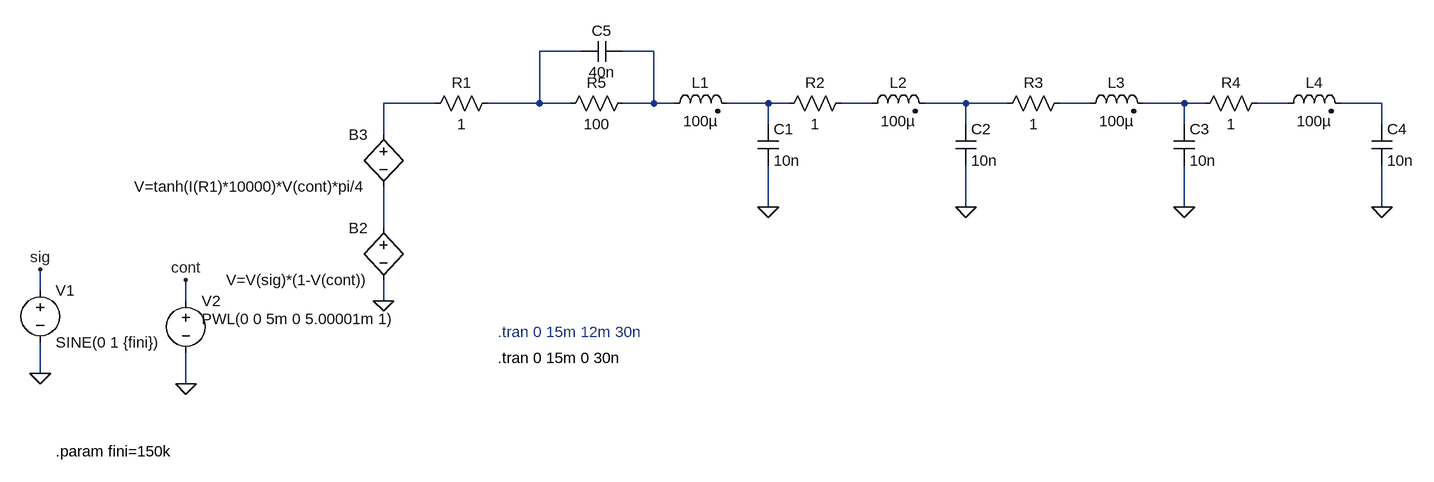
[diagram p0: schematic TLine_PTS_v2.asc]
TLine_PTS_v2.asc, the LTspice schematic file:
Version 4
SHEET 1 1736 680
WIRE 448 -128 384 -128
WIRE 560 -128 512 -128
WIRE 224 -48 144 -48
WIRE 384 -48 384 -128
WIRE 384 -48 304 -48
WIRE 432 -48 384 -48
WIRE 560 -48 560 -128
WIRE 560 -48 512 -48
WIRE 592 -48 560 -48
WIRE 736 -48 672 -48
WIRE 768 -48 736 -48
WIRE 896 -48 848 -48
WIRE 1040 -48 976 -48
WIRE 1104 -48 1040 -48
WIRE 1232 -48 1184 -48
WIRE 1376 -48 1312 -48
WIRE 1408 -48 1376 -48
WIRE 1536 -48 1488 -48
WIRE 1680 -48 1616 -48
WIRE 736 -16 736 -48
WIRE 1040 -16 1040 -48
WIRE 1376 -16 1376 -48
WIRE 1680 -16 1680 -48
WIRE 144 0 144 -48
WIRE 736 112 736 48
WIRE 1040 112 1040 48
WIRE 1376 112 1376 48
WIRE 1680 112 1680 48
WIRE 144 144 144 80
WIRE -384 240 -384 208
WIRE -160 256 -160 224
WIRE 144 256 144 224
WIRE -384 368 -384 320
WIRE -160 384 -160 336
FLAG -384 368 0
FLAG -160 384 0
FLAG -160 224 cont
FLAG -384 208 sig
FLAG 144 256 0
FLAG 736 112 0
FLAG 1040 112 0
FLAG 1376 112 0
FLAG 1680 112 0
SYMBOL res 208 -32 R270
WINDOW 0 32 56 VTop 2
WINDOW 3 0 56 VBottom 2
SYMATTR InstName R1
SYMATTR Value 1
SYMBOL voltage -384 224 R0
WINDOW 123 0 0 Left 0
WINDOW 39 0 0 Left 0
SYMATTR InstName V1
SYMATTR Value SINE(0 1 {fini})
SYMBOL voltage -160 240 R0
WINDOW 123 0 0 Left 0
WINDOW 39 0 0 Left 0
WINDOW 3 24 44 Left 2
SYMATTR Value PWL(0 0 5m 0 5.00001m 1)
SYMATTR InstName V2
SYMBOL bv 144 128 M0
SYMATTR InstName B2
SYMATTR Value V=V(sig)*(1-V(cont))
SYMBOL bv 144 -16 M0
SYMATTR InstName B3
SYMATTR Value V=tanh(I(R1)*10000)*V(cont)*pi/4
SYMBOL ind2 576 -32 R270
WINDOW 0 32 56 VTop 2
WINDOW 3 4 56 VBottom 2
SYMATTR InstName L1
SYMATTR Value 100µ
SYMATTR Type ind
SYMBOL cap 720 -16 R0
SYMATTR InstName C1
SYMATTR Value 10n
SYMBOL ind2 880 -32 R270
WINDOW 0 32 56 VTop 2
WINDOW 3 4 56 VBottom 2
SYMATTR InstName L2
SYMATTR Value 100µ
SYMATTR Type ind
SYMBOL res 864 -64 R90
WINDOW 0 0 56 VBottom 2
WINDOW 3 32 56 VTop 2
SYMATTR InstName R2
SYMATTR Value 1
SYMBOL cap 1024 -16 R0
SYMATTR InstName C2
SYMATTR Value 10n
SYMBOL ind2 1216 -32 R270
WINDOW 0 32 56 VTop 2
WINDOW 3 4 56 VBottom 2
SYMATTR InstName L3
SYMATTR Value 100µ
SYMATTR Type ind
SYMBOL cap 1360 -16 R0
SYMATTR InstName C3
SYMATTR Value 10n
SYMBOL ind2 1520 -32 R270
WINDOW 0 32 56 VTop 2
WINDOW 3 4 56 VBottom 2
SYMATTR InstName L4
SYMATTR Value 100µ
SYMATTR Type ind
SYMBOL res 1200 -64 R90
WINDOW 0 0 56 VBottom 2
WINDOW 3 32 56 VTop 2
SYMATTR InstName R3
SYMATTR Value 1
SYMBOL res 1504 -64 R90
WINDOW 0 0 56 VBottom 2
WINDOW 3 32 56 VTop 2
SYMATTR InstName R4
SYMATTR Value 1
SYMBOL cap 1664 -16 R0
SYMATTR InstName C4
SYMATTR Value 10n
SYMBOL res 528 -64 R90
WINDOW 0 0 56 VBottom 2
WINDOW 3 32 56 VTop 2
SYMATTR InstName R5
SYMATTR Value 100
SYMBOL cap 512 -144 R90
WINDOW 0 0 32 VBottom 2
WINDOW 3 32 32 VTop 2
SYMATTR InstName C5
SYMATTR Value 40n
TEXT 320 304 Left 2 ;.tran 0 15m 12m 30n
TEXT -360 488 Left 2 !.param fini=150k
TEXT 320 344 Left 2 !.tran 0 15m 0 30n

The netlist it stands for:
* TLine_PTS_v2.asc
R1 N003 N001 1
V1 sig 0 SINE(0 1 {fini})
V2 cont 0 PWL(0 0 5m 0 5.00001m 1)
B2 N011 0 V=V(sig)*(1-V(cont))
B3 N003 N011 V=tanh(I(R1)*10000)*V(cont)*pi/4
L1 N002 N004 100µ
C1 N004 0 10n
L2 N005 N006 100µ
R2 N005 N004 1
C2 N006 0 10n
L3 N007 N008 100µ
C3 N008 0 10n
L4 N009 N010 100µ
R3 N007 N006 1
R4 N009 N008 1
C4 N010 0 10n
R5 N002 N001 100
C5 N002 N001 40n
* .tran 0 15m 12m 30n
.param fini=150k
.tran 0 15m 0 30n
.backanno
.end